# Altium project UZ_D_Inverter.PrjPCB (part 2 of 2)

## Sheet Halfbridges.SchDoc
size A4; Author: K.Patel / D. Hufnagel; CompanyName: Technische Hochschule Nürnberg Georg Simon Ohm; Organization: UltraZohm; Address1: Kesslerplatz 12; Address2: 90489 Nürnberg; Address3: GERMANY; SheetNumber: 5; SheetTotal: 9; Website: www.ultrazohm.com
Used 3 times, as channels Halfbridge1, Halfbridge2, Halfbridge3. Parts and nets are listed once, with the designators drawn on the sheet.
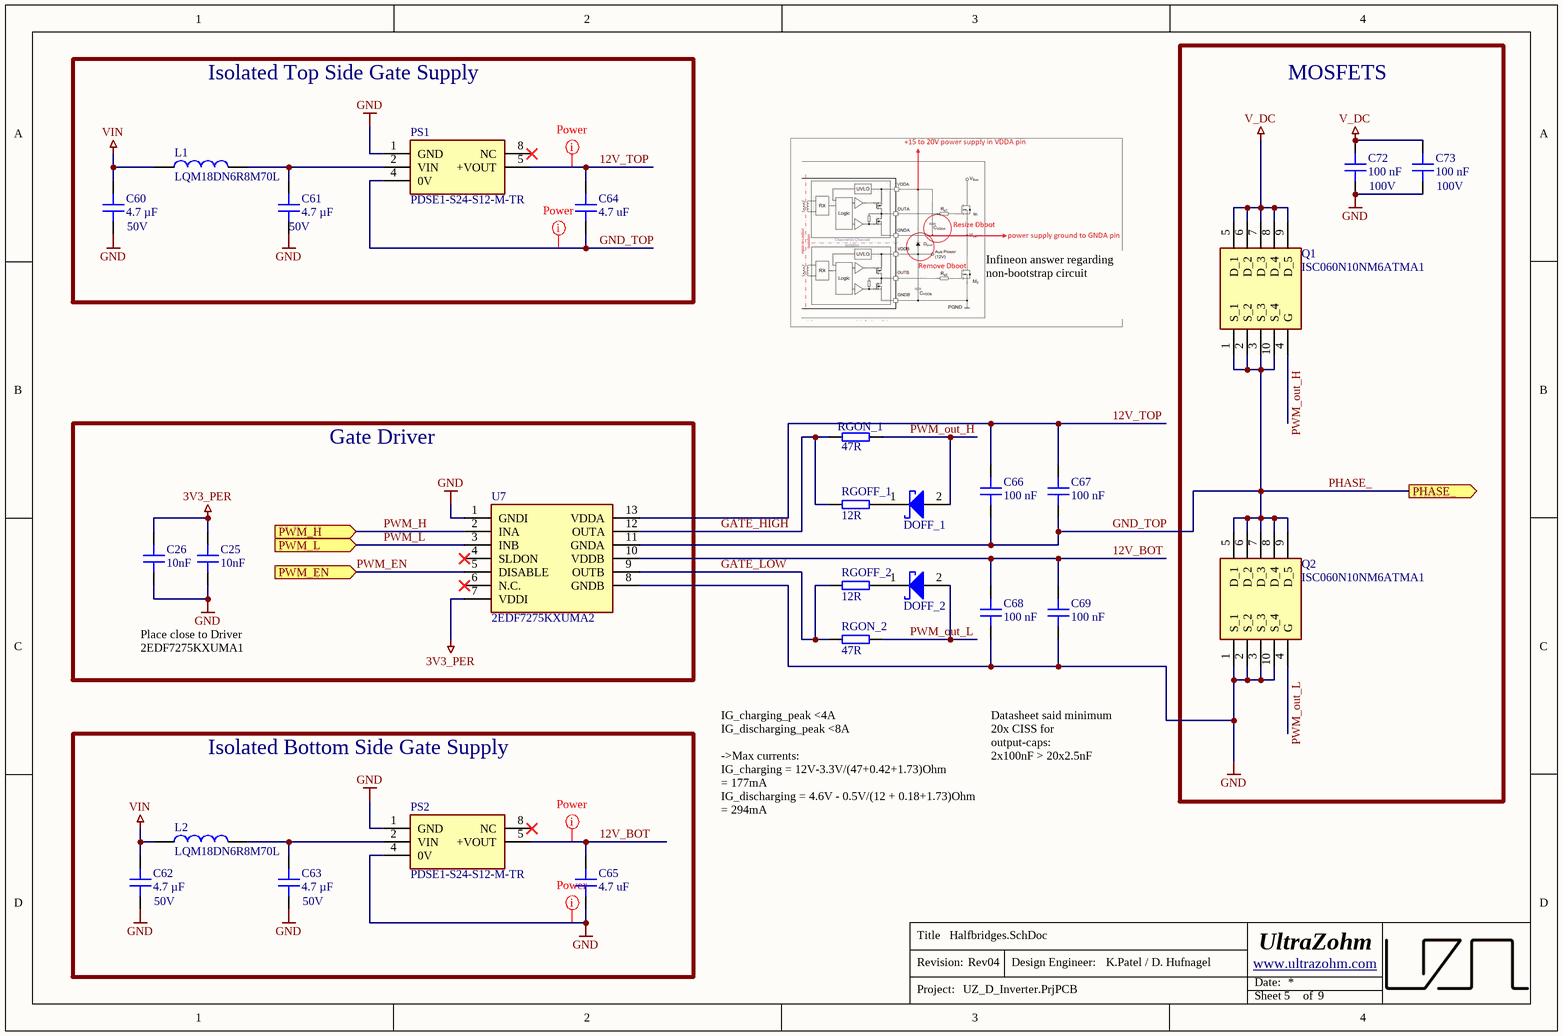
[diagram p4: Halfbridges.SchDoc]

### Parts
C25  10nF  [C_0603]
C26  10nF  [C_0603]
C60  4.7 µF  [C_0805]
C61  4.7 µF  [C_0805]
C62  4.7 µF  [C_0805]
C63  4.7 µF  [C_0805]
C64  4.7 uF  [C_0603]
C65  4.7 uF  [C_0603]
C66  100 nF  [C_0603]
C67  100 nF  [C_0603]
C68  100 nF  [C_0603]
C69  100 nF  [C_0603]
C72  100 nF  [C_0603]
C73  100 nF  [C_0603]
DOFF_1  BAT165E6327  [SOD2513X110N]  (value not drawn)
DOFF_2  BAT165E6327  [SOD2513X110N]  (value not drawn)
L1  LQM18DN6R8M70L  [INDC1608X95N]
L2  LQM18DN6R8M70L  [INDC1608X95N]
PS1  PDSE1-S24-S12-M-TR  [PDSE1S24S12MTR]
PS2  PDSE1-S24-S12-M-TR  [PDSE1S24S12MTR]
Q1  ISC060N10NM6ATMA1  [ISC060N10NM6ATMA1]
Q2  ISC060N10NM6ATMA1  [ISC060N10NM6ATMA1]
RGOFF_1  12R  [RESC1609X55N]
RGOFF_2  12R  [RESC1609X55N]
RGON_1  47R  [RESC1609X55N]
RGON_2  47R  [RESC1609X55N]
U7  2EDF7275KXUMA2  [2EDF7275KXUMA1]

### Blocks framed on the sheet
Isolated Top Side Gate Supply: C60 C61 C64 L1 PS1
MOSFETS: C72 C73 Q1 Q2
Gate Driver: C25 C26 U7
Isolated Bottom Side Gate Supply: C62 C63 C65 L2 PS2

### Ports
PHASE_ (out), PWM_EN (in), PWM_H (in), PWM_L (in)

### Nets
3V3_PER: C25.2 C26.2 U7.7(VDDI)
GND: C25.1 C26.1 C60.2 C61.2 C62.2 C63.2 C65.1 C68.1 C69.1 C72.1 C73.1 PS1.1(GND) PS2.1(GND) PS2.4(0V) Q2.1(S_1) Q2.2(S_2) Q2.3(S_3) Q2.10(S_4) U7.1(GNDI) U7.8(GNDB)
V_DC: C72.2 C73.2 Q1.5(D_1) Q1.6(D_2) Q1.7(D_3) Q1.8(D_4) Q1.9(D_5)
VIN: C60.1 C62.1 L1.1 L2.1
12V_BOT: C65.2 C68.2 C69.2 PS2.5(+VOUT) U7.10(VDDB)
12V_TOP: C64.2 C66.2 C67.2 PS1.5(+VOUT) U7.13(VDDA)
GATE_HIGH: RGOFF_1.1 RGON_1.1 U7.12(OUTA)
GATE_LOW: RGOFF_2.1 RGON_2.1 U7.9(OUTB)
GND_TOP: C64.1 C66.1 C67.1 PS1.4(0V) Q1.1(S_1) Q1.2(S_2) Q1.3(S_3) Q1.10(S_4) Q2.5(D_1) Q2.6(D_2) Q2.7(D_3) Q2.8(D_4) Q2.9(D_5) U7.11(GNDA) ; port PHASE_  [also labelled PHASE_]
PWM_EN: U7.5(DISABLE) ; port PWM_EN
PWM_H: U7.2(INA) ; port PWM_H
PWM_L: U7.3(INB) ; port PWM_L
PWM_out_H: DOFF_1.2(A) Q1.4(G) RGON_1.2
PWM_out_L: DOFF_2.2(A) Q2.4(G) RGON_2.2
NetC61_1: C61.1 L1.2 PS1.2(VIN)
NetC63_1: C63.1 L2.2 PS2.2(VIN)
NetDOFF_1_1: DOFF_1.1(K) RGOFF_1.2
NetDOFF_2_1: DOFF_2.1(K) RGOFF_2.2

Not connected (* = marked no-connect by the designer): PS1 8(NC)*; PS2 8(NC)*; U7 4(SLDON)* 6(N.C.)*

### Channels
Halfbridge1: designators end in A; ports PHASE_=GND_TOP PWM_EN=PWM_EN PWM_H=PWM_H PWM_L=PWM_L
Halfbridge2: designators end in B; ports PHASE_=GND_TOP PWM_EN=PWM_EN PWM_H=PWM_H PWM_L=PWM_L
Halfbridge3: designators end in C; ports PHASE_=GND_TOP PWM_EN=PWM_EN PWM_H=PWM_H PWM_L=PWM_L

### Layout directives
net class Power: 12V_BOT_Halfbridge1, 12V_TOP_Halfbridge1, GND, GND_TOP

### Notes on the sheet
- (near C60) 50V
- (near C61) 50V
- (near C72) 100V
- (near C73) 100V
- Infineon answer regarding non-bootstrap circuit
- Place close to Driver
  2EDF7275KXUMA1
- Datasheet said minimum 20x CISS for output-caps:
  2x100nF > 20x2.5nF
- IG_charging_peak <4A
  IG_discharging_peak <8A
  ->Max currents:
  IG_charging = 12V-3.3V/(47+0.42+1.73)Ohm
  = 177mA
  IG_discharging = 4.6V - 0.5V/(12 + 0.18+1.73)Ohm = 294mA
- (near C62) 50V
- (near C63) 50V
- Title
- Revision:
- Design Engineer:
- Date:
- Project:
- Sheet
- of

### Library data of the parts
C25 C26 = CT41G-0603-2X1-50V-0.01μF-K(N): 50V 10nF 2X1 ±10%; Manufacturer: TORCH; Voltage Rating: 50 VDC; Created from: KIlhan; Manufacturer Part Number: CT41G-0603-2X1-50V-0.01μF-K(N); PartID: 130; Created On: 05.07.2023 18:57:50; ComponentLink1Description: Datasheet; ComponentLink1URL: https://datasheet.lcsc.com/lcsc/1809291621_TORCH-CT41G-0603-2X1-50V-0-01-F-K-N_C136131.pdf; Component Type: Capacitor 0603; Device Package: 0603; Last Updated: 05.07.2023 18:57:50; Mounting Type: SMD; Operating Temperature: -55 - 125°C; Supplier 1: LCSC; Supplier Part Number 1: C136131; Type: Capacitor; Tolerance: 10 %; Value: 10nF; Live Cycle Status: 1; Stock number: not stored; LCSC Part Number: C136131
C60-C63 = C2012X7R1H475K125AC: Capacitor 0805, 50 VDC, 4.7 µF, X7R; Manufacturer: TDK; Tolerance: 10 %; Voltage Rating: 50 VDC; Created from: MGremer; Manufacturer Part Number: C2012X7R1H475K125AC; PartID: 15; Created On: 20.12.2020 13:54:13; ComponentLink1Description: Datasheet; ComponentLink1URL: https://product.tdk.com/info/en/catalog/datasheets/mlcc_commercial_general_en.pdf; Component Type: Capacitor 0805; Device Package: 0805; Last Updated: 21.02.2024 14:33:48; Mounting Type: SMD; Operating Temperature: -55 - 125°C; Series: C; Supplier 1: Mouser; Supplier Part Number 1: 810-C2012X7R475K125C; Type: Capacitor; Value: 4.7 µF; Live Cycle Status: 1; Stock number: Labor SMD Container; Supplier 2: LCSC; Supplier Part Number 2: C437557; LCSC Part Number: C437557
C64 C65 = C1608JB1V475M080AC: Multilayer Ceramic Capacitors MLCC - SMD/SMT RECOMMENDED ALT 810-C1608X5R1V475K; Manufacturer: TDK; Tolerance: 20 %; Voltage Rating: 35 VDC; Created from: KPatel; Manufacturer Part Number: C1608JB1V475M080AC; PartID: 159; Created On: 12/20/2020 1:54:13 PM; ComponentLink1Description: Datasheet; ComponentLink1URL: https://product.tdk.com/system/files/dam/doc/product/capacitor/ceramic/mlcc/catalog/mlcc_commercial_general_en.pdf; Component Type: Capacitor 0603; Device Package: 0603; Last Updated: 12/14/2022 12:14:21 PM; Mounting Type: SMD; Operating Temperature: -55 to 125°C; Series: X7R; Supplier 1: LCSC; Supplier Part Number 1: C3858973; Type: Capacitor; Value: 4.7 uF; Live Cycle Status: 1; LCSC Part Number: C3858973; Stock number: not stored
C66-C69 C72 C73 = C1608X7S2A104KT000N: 100V 100nF X7S ±10% 0603 Multilayer Ceramic Capacitors MLCC - SMD/SMT ROHS; Manufacturer: TDK; Voltage Rating: 100 VDC; Created from: AGeiger; Manufacturer Part Number: C1608X7S2A104KT000N; PartID: 148; Created On: 20.12.2020 13:54:13; ComponentLink1Description: Datasheet; ComponentLink1URL: https://datasheet.lcsc.com/lcsc/2304140030_TDK-C1608X7S2A104KT000N_C343025.pdf; Component Type: Capacitor 0603; Device Package: 0603; Last Updated: 14.12.2022 12:14:21; Mounting Type: SMD; Operating Temperature: -55 to 125°C; Series: X7R; Supplier 1: LCSC; Supplier Part Number 1: C343025; Type: Capacitor; Tolerance: 10 %; Value: 100 nF; Live Cycle Status: 1; Stock number: not stored; LCSC Part Number: C343025
DOFF_1 DOFF_2 = BAT165E6327: Schottky Diode, 40 V, 750mA; Manufacturer: Infineon Technologies; Forward Current: 0.75 A; Forward Voltage: 40V; Reverse Current: 50uA; Value: 40V; Created from: Kpatel; Manufacturer Part Number: BAT165E6327; PartID: 19; Created On: 6/11/2024 12:14:10 PM; ComponentLink1Description: Datasheet; ComponentLink1URL: https://www.mouser.de/datasheet/2/196/bat165series-12207.pdf; Component Type: Schottky Diode; Device Package: SOD-323-2; Last Updated: 7/30/2024 11:32:39 AM; Mounting Type: SMD; Operating Temperature: -65 - 150 °C; Series: BAT165; Supplier 1: Mouser; Supplier Part Number 1: 726-BAT165E6327; Supplier 2: JLC; Supplier Part Number 2: C533629; Type: Schottky Diode; Live Cycle Status: 1; Stock number: not stored
L1 L2 = LQM18DN6R8M70L: 6.8µH, 120mA, 0603, 740mOhm, 20%; Manufacturer: Murata; MF: EPCOS / TDK; Value: 6.8uH; DCR: 320m; Rated Current: 0.85 A; Type: fixed inductor; Created from: DHufnagel; MPN: B82464G4154M; Supplier 1: Mouser; Supplier Part Number 1: 81-LQM18DN6R8M70L; Manufacturer Part Number: LQM18DN6R8M70L; PartID: 10; Created On: 19.07.2022 15:47:17; ComponentLink1Description: Datasheet; ComponentLink1URL: https://www.mouser.de/datasheet/2/281/1/JELF243B_0086-2298241.pdf; Component Type: SMD fixed inductor; Device Package: SMD; Last Updated: 15.06.2023 16:03:16; Mounting Type: SMD; Operating Temperature: -40 - 125°C; Series: LQM18DN_70; Supplier 2: Digi-Key; Supplier Part Number 2: 490-LQM18DN6R8M70LCT-ND; DC current: 120mA; Live Cycle Status: 1; Stock number: not stored; LCSC Part Number: C1881372
PS1 PS2 = PDSE1-S24-S12-M-TR: Isolated, 21.6 -26.4Vin, 12V out, 1W, 84mA out; Manufacturer: CUI Inc.; Created from: DHufnagel; Manufacturer Part Number: PDSE1-S24-S12-M-TR; PartID: 21; Created On: 19.07.2022 14:22:00; ComponentLink1Description: Datasheet; ComponentLink1URL: https://www.mouser.de/datasheet/2/670/pdse1_m-1596038.pdf; Component Type: Isolated DC-DC Converter; Device Package: SMT-5; Last Updated: 05.07.2023 17:07:31; Mounting Type: SMT; Operating Temperature: -40 - 105°C; Series: PDSE1-M; Supplier 1: Mouser; Supplier Part Number 1: 490-PDSE1-S24-S12MTR; Supplier 2: Digi-Key; Supplier Part Number 2: 102-PDSE1-S24-S12-M-TRCT-ND; Type: isolated DC-DC Converter; Value: 1 W; Live Cycle Status: 1; Stock number: not stored; LCSC Part Number: C6730719
Q1 Q2 = ISC060N10NM6ATMA1: Power MOSFET, n-Channel, 97A, 100V; Manufacturer: Infineon Technologies; Value: 100V, 97A; Created from: DHufnagel; Manufacturer Part Number: ISC060N10NM6ATMA1; PartID: 3; Created On: 28.06.2022 07:55:49; ComponentLink1Description: Datasheet; ComponentLink1URL: https://www.mouser.de/datasheet/2/196/Infineon_ISC060N10NM6_DataSheet_v02_00_EN-2942434.pdf; Component Type: Power MOSFET; Device Package: PG-TDSON-8 FL; Last Updated: 21.02.2024 15:31:45; Mounting Type: SMD; Operating Temperature: -55 - 175°C; Series: ISC060N10; Supplier 1: Mouser; Supplier Part Number 1: 726-ISC060N10NM6ATMA; Supplier 2: RS-online; Supplier Part Number 2: 235-4869; Type: Power MOSFET; Live Cycle Status: 1; Stock number: not stored; Supplier 3: LCSC; Supplier Part Number 3: C3288847; LCSC Part Number: C3288847
RGOFF_1 RGOFF_2 = RT0603WRC0712RL: SMD resistor E24 series; Manufacturer: YAGEO; Tolerance: 0.05%; Created from: K.Patel; Manufacturer Part Number: RT0603WRC0712RL; PartID: 349; Created On: 8/14/2024 5:03:13 PM; ComponentLink1Description: Datasheet; ComponentLink1URL: https://wmsc.lcsc.com/wmsc/upload/file/pdf/v2/lcsc/2403111543_YAGEO-RT0603WRC0712RL_C1720876.pdf; Component Type: SMD resistor; Device Package: 0603; Last Updated: 8/14/2024 5:03:13 PM; Mounting Type: SMD; Supplier 1: Mouser; Supplier Part Number 1: C1720876; Supplier 2: LCSC; Supplier Part Number 2: C1720876; Type: Resistor; Value: 12R; Live Cycle Status: 1; LCSC Part Number: C1720876
RGON_1 RGON_2 = RT0603WRC0747RL: SMD resistor E24 series; Manufacturer: YAGEO; Tolerance: 0.05%; Created from: K.Patel; Manufacturer Part Number: RT0603WRC0747RL; PartID: 350; Created On: 8/14/2024 5:03:13 PM; ComponentLink1Description: Datasheet; ComponentLink1URL: https://wmsc.lcsc.com/wmsc/upload/file/pdf/v2/lcsc/2403111541_YAGEO-RT0603WRC0747RL_C1718809.pdf; Component Type: SMD resistor; Device Package: 0603; Last Updated: 8/14/2024 5:03:13 PM; Mounting Type: SMD; Supplier 1: Mouser; Supplier Part Number 1: C1718809; Supplier 2: LCSC; Supplier Part Number 2: C1718809; Type: Resistor; Value: 47R; Live Cycle Status: 1; LCSC Part Number: C1718809
U7 = 2EDF7275KXUMA2: Gate Driver  8A, 1.5 kV, daul channel isolated gate driver; Manufacturer: Infineon Technologies; Created from: AGeiger; Manufacturer Part Number: 2EDF7275KXUMA2; PartID: 7; Created On: 21.02.2024 16:40:21; ComponentLink1Description: Datasheet; ComponentLink1URL: https://datasheet.lcsc.com/lcsc/2202151130_Infineon-Technologies-2EDF7275KXUMA2_C2975252.pdf; Component Type: Gate Driver; Device Package: PG-TFLGA-13-1; Last Updated: 21.02.2024 16:40:21; Mounting Type: SMD; Operating Temperature: -40 - 125°C; Supplier 1: LCSC; Supplier Part Number 1: C2975252; Type: Gate Driver; Live Cycle Status: 1; Stock number: not stored; LCSC Part Number: C2975252

## Sheet DC-link.SchDoc
size A4; Author: K.Patel / D. Hufnagel; CompanyName: Technische Hochschule Nürnberg Georg Simon Ohm; Organization: UltraZohm; Address1: Kesslerplatz 12; Address2: 90489 Nürnberg; Address3: GERMANY; SheetNumber: 6; SheetTotal: 9; Website: www.ultrazohm.com
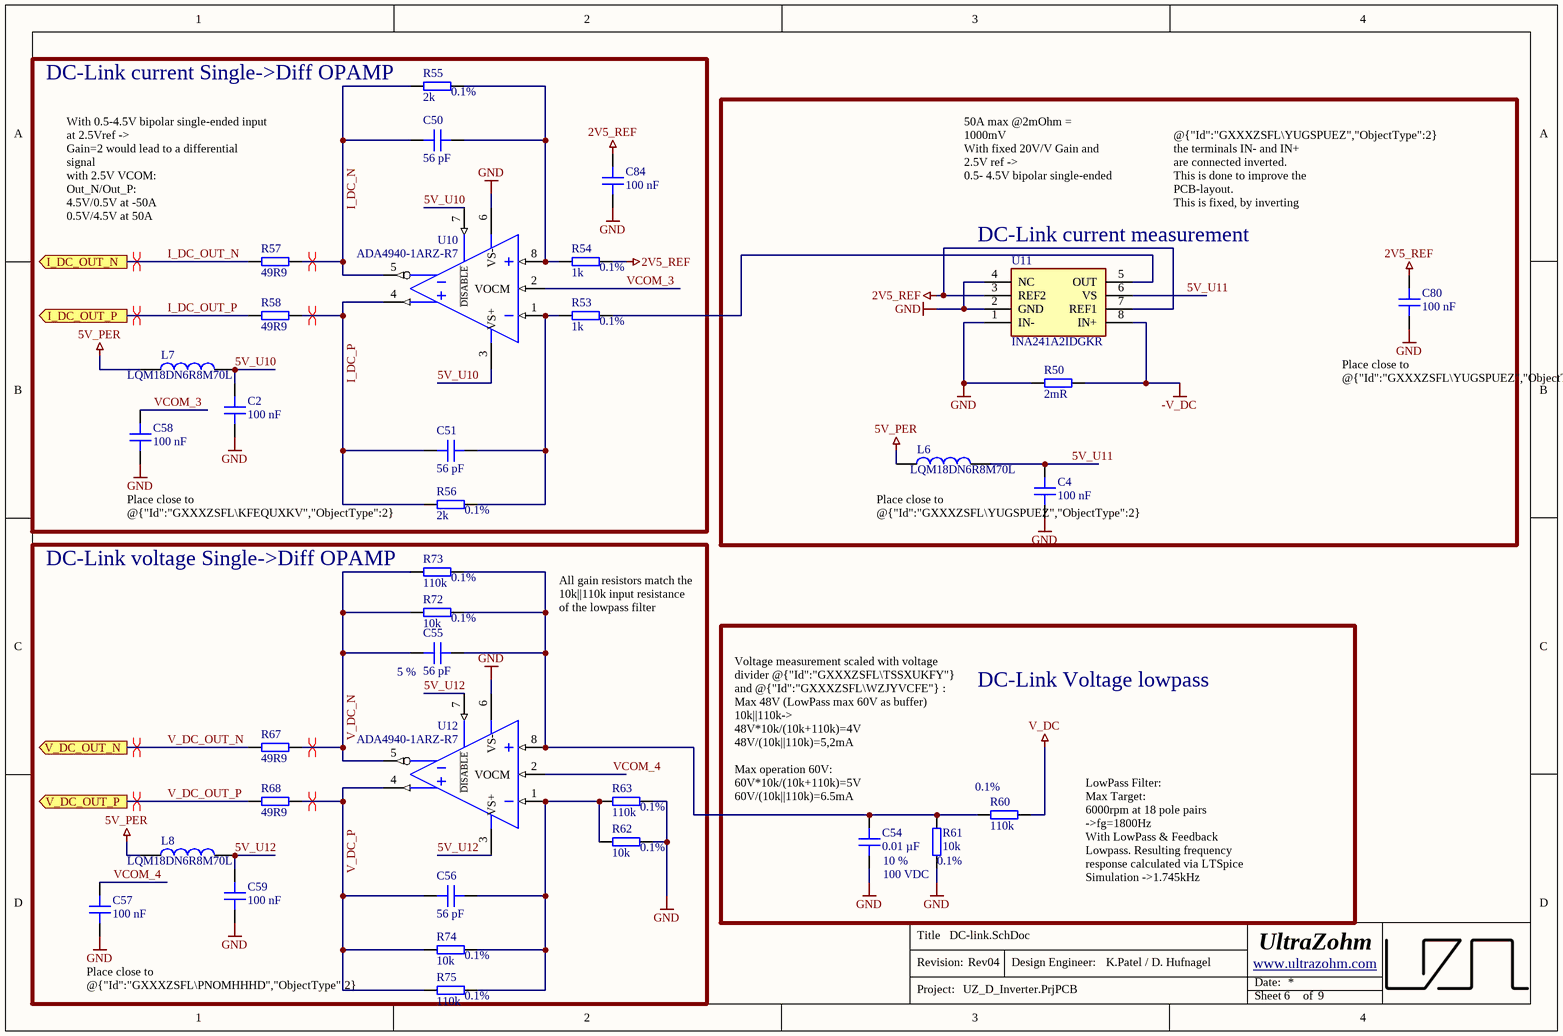
[diagram p5: DC-link.SchDoc]

### Parts
C2  100 nF  [C_0603]
C4  100 nF  [C_0603]
C50  56 pF  [C_0603]
C51  56 pF  [C_0603]
C54  0.01 µF  Tolerance: 10 %  Voltage Rating: 100 VDC  [C_0805]
C55  56 pF  Tolerance: 5 %  [C_0603]
C56  56 pF  [C_0603]
C57  100 nF  [C_0603]
C58  100 nF  [C_0603]
C59  100 nF  [C_0603]
C80  100 nF  [C_0603]
C84  100 nF  [C_0603]
L6  LQM18DN6R8M70L  [INDC1608X95N]
L7  LQM18DN6R8M70L  [INDC1608X95N]
L8  LQM18DN6R8M70L  [INDC1608X95N]
R50  2mR  [3921]
R53  1k  Tolerance: 0.1%  [RES 0603_1608]
R54  1k  Tolerance: 0.1%  [RES 0603_1608]
R55  2k  Tolerance: 0.1%  [RES 0603_1608]
R56  2k  Tolerance: 0.1%  [RES 0603_1608]
R57  49R9  [RES 0603_1608]
R58  49R9  [RES 0603_1608]
R60  110k  Tolerance: 0.1%  [RES 0603_1608]
R61  10k  [RES 0603_1608]
R62  10k  Tolerance: 0.1%  [RES 0603_1608]
R63  110k  Tolerance: 0.1%  [RES 0603_1608]
R67  49R9  [RES 0603_1608]
R68  49R9  [RES 0603_1608]
R72  10k  Tolerance: 0.1%  [RES 0603_1608]
R73  110k  Tolerance: 0.1%  [RES 0603_1608]
R74  10k  Tolerance: 0.1%  [RES 0603_1608]
R75  110k  Tolerance: 0.1%  [RES 0603_1608]
U10  ADA4940-1ARZ-R7  [SOT127P600X175-8N]
U11  INA241A2IDGKR  [SOP65P490X110-8N]
U12  ADA4940-1ARZ-R7  [SOT127P600X175-8N]

### Blocks framed on the sheet
DC-Link current Single->Diff OPAMP: C2 C50 C51 C58 C84 L7 R53-R58 U10
DC-Link current measurement: C4 C80 L6 R50 U11
DC-Link voltage Single->Diff OPAMP: C55-C57 C59 L8 R62 R63 R67 R68 R72-R75 U12
DC-Link Voltage lowpass: C54 R60 R61

### Ports
I_DC_OUT_N (out), I_DC_OUT_P (out), V_DC_OUT_N (out), V_DC_OUT_P (out)

### Nets
2V5_REF: C80.2 C84.2 R54.2 U11.3(REF2) U11.7(REF1)
5V_PER: L6.1 L7.1 L8.1
-V_DC: R50.2 U11.8(IN+)
GND: C2.1 C4.1 C54.1 C57.1 C58.1 C59.1 C80.1 C84.1 R50.1 R61.1 R62.1 R63.2 U10.6(VS-) U11.1(IN-) U11.2(GND) U11.4(NC) U12.6(VS-)
V_DC: R60.2
5V_U10: C2.2 L7.2 U10.3(VS+) U10.7(~{DISABLE})
5V_U11: C4.2 L6.2 U11.6(VS)
5V_U12: C59.2 L8.2 U12.3(VS+) U12.7(~{DISABLE})
I_DC_N: C50.1 R55.1 R57.2 U10.5(VOUT-)
I_DC_OUT_N: R57.1 ; port I_DC_OUT_N
I_DC_OUT_P: R58.1 ; port I_DC_OUT_P
I_DC_P: C51.2 R56.2 R58.2 U10.4(VOUT+)
V_DC_N: C55.1 R67.2 R72.2 R73.1 U12.5(VOUT-)
V_DC_OUT_N: R67.1 ; port V_DC_OUT_N
V_DC_OUT_P: R68.1 ; port V_DC_OUT_P
V_DC_P: C56.2 R68.2 R74.2 R75.1 U12.4(VOUT+)
VCOM_3: C58.2 U10.2(VOCM)
VCOM_4: C57.2 U12.2(VOCM)
NetC50_2: C50.2 R54.1 R55.2 U10.8(VIN+)
NetC51_1: C51.1 R53.1 R56.1 U10.1(VIN-)
NetC54_2: C54.2 C55.2 R60.1 R61.2 R72.1 R73.2 U12.8(VIN+)
NetC56_1: C56.1 R62.2 R63.1 R74.1 R75.2 U12.1(VIN-)
NetR53_2: R53.2 U11.5(OUT)

### Layout directives
differential pair: I_DC_N, I_DC_OUT_N, I_DC_OUT_P, I_DC_P, V_DC_N, V_DC_OUT_N, V_DC_OUT_P, V_DC_P

### Notes on the sheet
- (near R57) With 0.5-4.5V bipolar single-ended input at 2.5Vref ->
  Gain=2 would lead to a differential signal
  with 2.5V VCOM:
  Out_N/Out_P:
  4.5V/0.5V at -50A
  0.5V/4.5V at 50A
- 50A max @2mOhm = 1000mV
  With fixed 20V/V Gain and 2.5V ref ->
  0.5- 4.5V bipolar single-ended
- @{"Id":"GXXXZSFL\YUGSPUEZ","ObjectType":2} the terminals IN- and IN+ are connected inverted. This is done to improve the PCB-layout.
  This is fixed, by inverting the inputs at @{"Id":"GXXXZSFL\KFEQUXKV","ObjectType":2} again.
- (near C80) Place close to @{"Id":"GXXXZSFL\YUGSPUEZ","ObjectType":2} REF inputs
- (near C58) Place close to @{"Id":"GXXXZSFL\KFEQUXKV","ObjectType":2} OPAMP
- Place close to @{"Id":"GXXXZSFL\YUGSPUEZ","ObjectType":2} OPAMP
- All gain resistors match the 10k||110k input resistance of the lowpass filter
- Voltage measurement scaled with voltage divider @{"Id":"GXXXZSFL\TSSXUKFY"} and @{"Id":"GXXXZSFL\WZJYVCFE"} :
  Max 48V (LowPass max 60V as buffer)
  10k||110k->
  48V*10k/(10k+110k)=4V
  48V/(10k||110k)=5,2mA
  Max operation 60V:
  60V*10k/(10k+110k)=5V
  60V/(10k||110k)=6.5mA
- (near R61) 0.1%
- LowPass Filter:
  Max Target:
  6000rpm at 18 pole pairs
  ->fg=1800Hz
  With LowPass & Feedback Lowpass. Resulting frequency response calculated via LTSpice Simulation ->1.745kHz
- Place close to @{"Id":"GXXXZSFL\PNOMHHHD","ObjectType":2} OPAMP
- Title
- Revision:
- Design Engineer:
- Date:
- Project:
- Sheet
- of

### Library data of the parts
C2 C4 C57-C59 C80 C84 = C1608X7S2A104KT000N: as C66 on sheet Halfbridges; Manufacturer Part Number: C1608X7S2A104KT000N; PartID: 148; Created On: 20.12.2020 13:54:13; ComponentLink1Description: Datasheet; ComponentLink1URL: https://datasheet.lcsc.com/lcsc/2304140030_TDK-C1608X7S2A104KT000N_C343025.pdf; Component Type: Capacitor 0603; Device Package: 0603; Last Updated: 14.12.2022 12:14:21; Mounting Type: SMD; Operating Temperature: -55 to 125°C; Series: X7R; Supplier 1: LCSC; Supplier Part Number 1: C343025; Type: Capacitor; Tolerance: 10 %; Value: 100 nF; Live Cycle Status: 1; Stock number: not stored; LCSC Part Number: C343025
C50 C51 C56 = CL10C560JB8NNNC: Capacitor 0603, 50 VDC, 56 pF, C0G; Manufacturer: Samsung Electro-Mechanics; Tolerance: 5 %; Voltage Rating: 50 VDC; Created from: DHufnagel; Manufacturer Part Number: CL10C560JB8NNNC; PartID: 92; Created On: 20.12.2020 13:54:13; ComponentLink1Description: Datasheet; ComponentLink1URL: https://www.mouser.de/datasheet/2/585/MLCC-1837944.pdf; Component Type: Capacitor 0603; Device Package: 0603; Last Updated: 20.12.2020 16:24:16; Mounting Type: SMD; Operating Temperature: -55 - 125°C; Series: CL; Supplier 1: Mouser; Supplier Part Number 1: 187-CL10C560JB8NNNC; Supplier 2: LCSC; Supplier Part Number 2: C39148; Type: Capacitor; Value: 56 pF; Live Cycle Status: 1; LCSC Part Number: C39148; Stock number: not stored
C54 = HV0805X7R103K101NT: 100V 10nF 0805 Multilayer Ceramic Capacitors MLCC - SMD/SMT ROHS; Manufacturer: AIDE; Created from: KIlhan; Manufacturer Part Number: HV0805X7R103K101NT; PartID: 128; Created On: 05.07.2023 15:42:28; ComponentLink1Description: Datasheet; ComponentLink1URL: https://datasheet.lcsc.com/lcsc/2103311437_AIDE-HV1210X7R332K202NT_C2691813.pdf; Component Type: Capacitor 0805; Device Package: 0805; Last Updated: 05.07.2023 15:42:28; Mounting Type: SMD; Operating Temperature: -55 - 125°C; Series: C; Supplier 1: JLCPCB; Supplier Part Number 1: HV0805X7R103K101NT; Type: Capacitor; Value: 0.01 µF; Live Cycle Status: 1; Stock number: not stored; LCSC Part Number: C2691724
C55 = CL10C560JB8NNNC: Capacitor 0603, 50 VDC, 56 pF, C0G; Manufacturer: Samsung Electro-Mechanics; Voltage Rating: 50 VDC; Created from: DHufnagel; Manufacturer Part Number: CL10C560JB8NNNC; PartID: 92; Created On: 20.12.2020 13:54:13; ComponentLink1Description: Datasheet; ComponentLink1URL: https://www.mouser.de/datasheet/2/585/MLCC-1837944.pdf; Component Type: Capacitor 0603; Device Package: 0603; Last Updated: 20.12.2020 16:24:16; Mounting Type: SMD; Operating Temperature: -55 - 125°C; Series: CL; Supplier 1: Mouser; Supplier Part Number 1: 187-CL10C560JB8NNNC; Type: Capacitor; Value: 56 pF; Live Cycle Status: 1; Stock number: not stored; Supplier 2: LCSC; Supplier Part Number 2: C39148; LCSC Part Number: C39148
L6-L8 = LQM18DN6R8M70L: as L1 on sheet Halfbridges; MPN: B82464G4154M; Supplier 1: Mouser; Supplier Part Number 1: 81-LQM18DN6R8M70L; Manufacturer Part Number: LQM18DN6R8M70L; PartID: 10; Created On: 19.07.2022 15:47:17; ComponentLink1Description: Datasheet; ComponentLink1URL: https://www.mouser.de/datasheet/2/281/1/JELF243B_0086-2298241.pdf; Component Type: SMD fixed inductor; Device Package: SMD; Last Updated: 15.06.2023 16:03:16; Mounting Type: SMD; Operating Temperature: -40 - 125°C; Series: LQM18DN_70; Supplier 2: Digi-Key; Supplier Part Number 2: 490-LQM18DN6R8M70LCT-ND; DC current: 120mA; Live Cycle Status: 1; Stock number: not stored; LCSC Part Number: C1881372
R50 = PU3921FKMP50R002L: Shunt resistor 2mOhm, 5W, 1%; Manufacturer Part Number: WSL39212L000FEA; Manufacturer: Vishay; Created from: DHufnagel; PartID: 236; Created On: 12.07.2022 07:38:48; ComponentLink1Description: Datasheet; ComponentLink1URL: https://www.mouser.de/datasheet/2/447/PYu_PU_51_RoHS_L_8-3003083.pdf; Component Type: Shunt SMD resistor; Device Package: 3921; Last Updated: 16.06.2023 12:23:12; Mounting Type: SMD; Supplier 1: Mouser; Supplier Part Number 1: 71-WSL39212L000FEA; Type: Shunt; Tolerance: 1%; Value: 2mR; Live Cycle Status: 1; Stock number: not stored; LCSC Part Number: C844494
R53 R54 = PCF-W0603LF-03-1001-B-P-LT: SMD resistor 0.1%; Manufacturer: IRC / TT Electronics; Created from: MGremer; Manufacturer Part Number: PCF-W0603LF-03-1001-B-P-LT; PartID: 163; Created On: 14.12.2020 16:17:14; ComponentLink1Description: Datasheet; ComponentLink1URL: https://www.mouser.de/datasheet/2/414/PCF-1528243.pdf; Component Type: SMD resistor; Device Package: 0603; Last Updated: 21.02.2024 15:45:55; Mounting Type: SMD; Supplier 1: Mouser; Supplier Part Number 1: 66-PCFW0603LF031001B; Type: Resistor; Value: 1k; Live Cycle Status: 1; Stock number: not stored; LCSC Part Number: C110776
R55 R56 = ERJ-PB3B2001V: SMD resistor 0.1%; Manufacturer: Panasonic; Created from: DHufnagel; Manufacturer Part Number: ERJ-PB3B2001V; PartID: 215; Created On: 14.12.2020 16:17:14; ComponentLink1Description: Datasheet; ComponentLink1URL: https://www.mouser.de/datasheet/2/315/AOA0000C328-1530132.pdf; Component Type: SMD resistor; Device Package: 0603; Last Updated: 02.03.2021 14:07:32; Mounting Type: SMD; Supplier 1: Mouser; Supplier Part Number 1: 667-ERJ-PB3B2001V; Supplier 2: LCSC; Supplier Part Number 2: C189729; Type: Resistor; Value: 2k; Live Cycle Status: 1; Stock number: not stored; LCSC Part Number: C189729
R57 R58 R67 R68 = RK73H1JTTD49R9F: SMD resistor 1%; Manufacturer: KOA Speer; Created from: DHufnagel; Manufacturer Part Number: RK73H1JTTD49R9F; PartID: 214; Created On: 14.12.2020 16:17:14; ComponentLink1Description: Datasheet; ComponentLink1URL: https://www.mouser.de/datasheet/2/219/RK73H-1825326.pdf; Component Type: SMD resistor; Device Package: 0603; Last Updated: 27.05.2022 13:46:35; Mounting Type: SMD; Supplier 1: Mouser; Supplier Part Number 1: 660-RK73H1JTTD49R9F; Supplier 2: LCSC; Supplier Part Number 2: C160046; Type: Resistor; Tolerance: 1%; Value: 49R9; Live Cycle Status: 1; Stock number: not stored; LCSC Part Number: C160046
R60 R63 R73 R75 = RQ73C1J110KBTD: SMD resistor 0.1%, 10ppm; Manufacturer: TE Connectivity / Holsworthy; Created from: DHufnagel; Manufacturer Part Number: RQ73C1J110KBTD; PartID: 216; Created On: 14.12.2020 16:17:14; ComponentLink1Description: Datasheet; ComponentLink1URL: https://www.mouser.de/datasheet/2/418/5/ENG_DS_1773270_2_B-1533717.pdf; Component Type: SMD resistor; Device Package: 0603; Last Updated: 21.02.2024 16:00:52; Mounting Type: SMD; Supplier 1: Mouser; Supplier Part Number 1: 279-RQ73C1J110KBTD; Type: Resistor; Value: 110k; Live Cycle Status: 1; Stock number: not stored; Supplier 2: LCSC; Supplier Part Number 2: C326736; LCSC Part Number: C326736
R61 R62 R72 R74 = RQ73C1J10KBTD: SMD resistor 0.1%, 10ppm; Manufacturer: TE Connectivity; Created from: DHufnagel; Manufacturer Part Number: RQ73C1J10KBTD; PartID: 231; Created On: 14.12.2020 16:17:14; ComponentLink1Description: Datasheet; ComponentLink1URL: https://www.mouser.de/datasheet/2/418/5/ENG_DS_1773270_2_B-1533717.pdf; Component Type: SMD resistor; Device Package: 0603; Last Updated: 21.02.2024 15:51:17; Mounting Type: SMD; Supplier 1: Mouser; Supplier Part Number 1: 279-RQ73C1J10KBTD; Type: Resistor; Value: 10k; Live Cycle Status: 1; Stock number: not stored; Supplier 2: LCSC; Supplier Part Number 2: C95204; LCSC Part Number: C95204
  R61: Tolerance: 0.1%
U10 U12 = ADA4940-1ARZ-R7: Fully Differential Amplifier, Ultralow-Power,Low Distortion, 260-MHz; Manufacturer: Analog Devices; Channels: 1; GBP: 260 MHz; CMRR: 86 dB; Created from: DHufnagel; Manufacturer Part Number: ADA4940-1ARZ-R7; PartID: 14; Created On: 18.08.2022 12:53:27; ComponentLink1Description: Datasheet; ComponentLink1URL: https://www.mouser.de/datasheet/2/609/ada4940_1_4940_2-2955874.pdf; Component Type: Differential Amplifier; Device Package: SOIC-8; Last Updated: 18.08.2022 13:04:18; Mounting Type: SMD; Operating Temperature: -40 - 105°C; Series: ADA4940-1; Supplier 1: Mouser; Supplier Part Number 1: 584-ADA4940-1ARZ; Supplier 2: Digi-Key; Supplier Part Number 2: 505-ADA4940-1ARZ-ND; Supplier 3: LCSC; Supplier Part Number 3: C730049; Type: Differential Amplifiers; Live Cycle Status: 1; LCSC Part Number: C730049; Stock number: not stored
U11 = INA241A2IDGKR: Current Sense Amplifier, 5-100 V  CMV, 20 V/V, bidirectional; Manufacturer: Texas Instruments; Channels: 1; GBP: 100MHz; CMRR: 89dB; Value: Rail-to-Rail; Created from: KPatel; Manufacturer Part Number: INA241A2IDGKR; PartID: 30; Created On: 6/28/2024 9:00:46 AM; ComponentLink1Description: Datasheet; ComponentLink1URL: https://www.ti.com/lit/ds/symlink/ina241b.pdf?ts=1718088817119&ref_url=https%253A%252F%252Fwww.mouser.de%252F; Component Type: Current Sense Amplifier; Device Package: VSSOP-8; Last Updated: 6/28/2024 9:00:46 AM; Mounting Type: SMD; Operating Temperature: -40 - 125°C; Series: INA241A; Supplier 1: Mouser; Supplier Part Number 1: 595-INA241A2IDGKR; Type: Current Sense Amplifier; Live Cycle Status: 1; Stock number: not stored

## Sheet Temp_Measurements.SchDoc
size A4; Author: K.Patel / D. Hufnagel; CompanyName: Technische Hochschule Nürnberg Georg Simon Ohm; Organization: UltraZohm; Address1: Kesslerplatz 12; Address2: 90489 Nürnberg; Address3: GERMANY; SheetNumber: 8; SheetTotal: 9; Website: www.ultrazohm.com
Used 3 times, as channels TempMeasurements1, TempMeasurements2, TempMeasurements3. Parts and nets are listed once, with the designators drawn on the sheet.
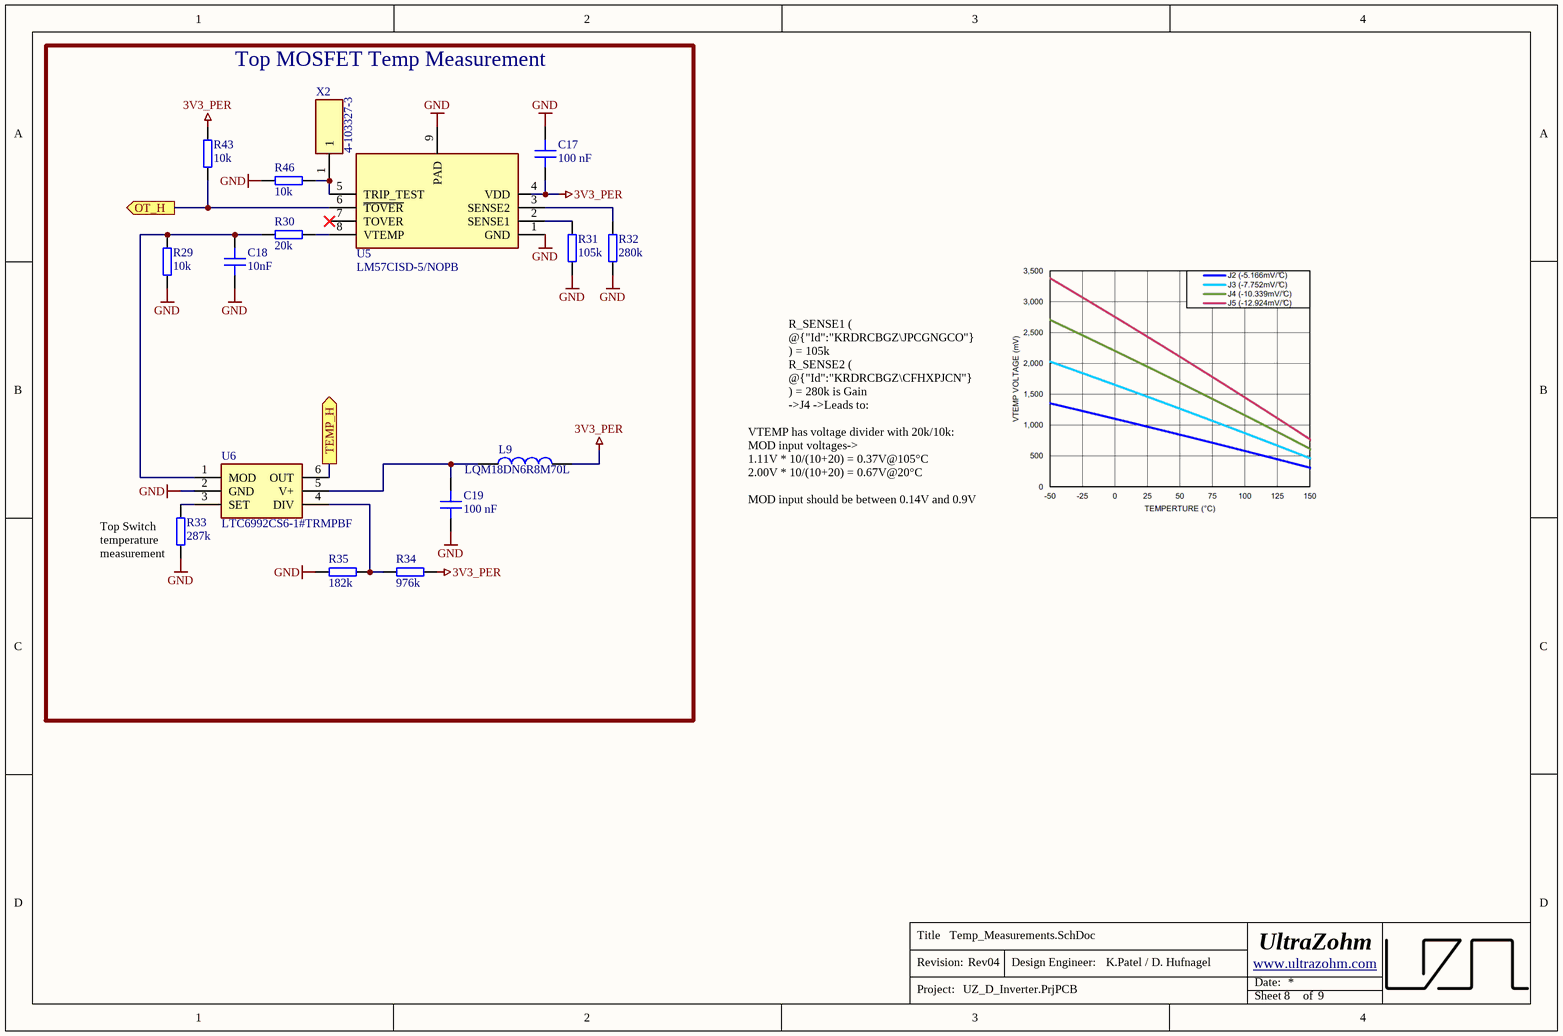
[diagram p6: Temp_Measurements.SchDoc]

### Parts
C17  100 nF  [C_0603]
C18  10nF  [C_0603]
C19  100 nF  [C_0603]
L9  LQM18DN6R8M70L  [INDC1608X95N]
R29  10k  [RES 0603_1608]
R30  20k  [RES 0603_1608]
R31  105k  [RES 0603_1608]
R32  280k  [RES 0603_1608]
R33  287k  [RES 0805_2012]
R34  976k  [RES 0603_1608]
R35  182k  [RES 0603_1608]
R43  10k  [RES 0603_1608]
R46  10k  [RES 0603_1608]
U5  LM57CISD-5/NOPB  [SON50P250X250X80-9N]
U6  LTC6992CS6-1#TRMPBF  [SOT95P280X100-6N]
X2  4-103327-3  [1_Pin_Header]

### Blocks framed on the sheet
Top MOSFET Temp Measurement: C17-C19 L9 R29-R35 R43 R46 U5 U6 X2

### Ports
OT_H (out), TEMP_H (out)

### Nets
3V3_PER: C17.1 L9.2 R34.2 R43.1 U5.4(VDD)
GND: C17.2 C18.1 C19.1 R29.2 R31.1 R32.1 R33.1 R35.1 R46.2 U5.1(GND) U5.9(PAD) U6.2(GND)
OT_H: R43.2 U5.6(~{TOVER}) ; port OT_H
TEMP_H: U6.6(OUT) ; port TEMP_H
NetC18_2: C18.2 R29.1 R30.1 U6.1(MOD)
NetC19_2: C19.2 L9.1 U6.5(V+)
NetR30_2: R30.2 U5.8(VTEMP)
NetR31_2: R31.2 U5.2(SENSE1)
NetR32_2: R32.2 U5.3(SENSE2)
NetR33_2: R33.2 U6.3(SET)
NetR34_1: R34.1 R35.2 U6.4(DIV)
NetR46_1: R46.1 U5.5(TRIP_TEST) X2.1

Not connected (* = marked no-connect by the designer): U5 7(TOVER)*

### Channels
TempMeasurements1: designators end in A; ports OT_H=OT_H1 TEMP_H=TEMP_H1
TempMeasurements2: designators end in B; ports OT_H=OT_H2 TEMP_H=TEMP_H2
TempMeasurements3: designators end in C; ports OT_H=OT_H3 TEMP_H=TEMP_H3

### Notes on the sheet
- R_SENSE1 ( @{"Id":"KRDRCBGZ\JPCGNGCO"} ) = 105k
  R_SENSE2 ( @{"Id":"KRDRCBGZ\CFHXPJCN"} ) = 280k is Gain
  ->J4 ->Leads to:
  1.11V@105°C
  2.00V@20°C
  /TOVER trips at 105°C
- VTEMP has voltage divider with 20k/10k:
  MOD input voltages->
  1.11V * 10/(10+20) = 0.37V@105°C
  2.00V * 10/(10+20) = 0.67V@20°C
  MOD input should be between 0.14V and 0.9V
- (near R33) Top Switch temperature measurement
- Title
- Revision:
- Design Engineer:
- Date:
- Project:
- Sheet
- of

### Library data of the parts
C17 C19 = C1608X7S2A104KT000N: as C66 on sheet Halfbridges; Manufacturer Part Number: C1608X7S2A104KT000N; PartID: 148; Created On: 20.12.2020 13:54:13; ComponentLink1Description: Datasheet; ComponentLink1URL: https://datasheet.lcsc.com/lcsc/2304140030_TDK-C1608X7S2A104KT000N_C343025.pdf; Component Type: Capacitor 0603; Device Package: 0603; Last Updated: 14.12.2022 12:14:21; Mounting Type: SMD; Operating Temperature: -55 to 125°C; Series: X7R; Supplier 1: LCSC; Supplier Part Number 1: C343025; Type: Capacitor; Tolerance: 10 %; Value: 100 nF; Live Cycle Status: 1; Stock number: not stored; LCSC Part Number: C343025
C18 = CT41G-0603-2X1-50V-0.01μF-K(N): as C25 on sheet Halfbridges; Manufacturer Part Number: CT41G-0603-2X1-50V-0.01μF-K(N); PartID: 130; Created On: 05.07.2023 18:57:50; ComponentLink1Description: Datasheet; ComponentLink1URL: https://datasheet.lcsc.com/lcsc/1809291621_TORCH-CT41G-0603-2X1-50V-0-01-F-K-N_C136131.pdf; Component Type: Capacitor 0603; Device Package: 0603; Last Updated: 05.07.2023 18:57:50; Mounting Type: SMD; Operating Temperature: -55 - 125°C; Supplier 1: LCSC; Supplier Part Number 1: C136131; Type: Capacitor; Tolerance: 10 %; Value: 10nF; Live Cycle Status: 1; Stock number: not stored; LCSC Part Number: C136131
L9 = LQM18DN6R8M70L: as L1 on sheet Halfbridges; MPN: B82464G4154M; Supplier 1: Mouser; Supplier Part Number 1: 81-LQM18DN6R8M70L; Manufacturer Part Number: LQM18DN6R8M70L; PartID: 10; Created On: 19.07.2022 15:47:17; ComponentLink1Description: Datasheet; ComponentLink1URL: https://www.mouser.de/datasheet/2/281/1/JELF243B_0086-2298241.pdf; Component Type: SMD fixed inductor; Device Package: SMD; Last Updated: 15.06.2023 16:03:16; Mounting Type: SMD; Operating Temperature: -40 - 125°C; Series: LQM18DN_70; Supplier 2: Digi-Key; Supplier Part Number 2: 490-LQM18DN6R8M70LCT-ND; DC current: 120mA; Live Cycle Status: 1; Stock number: not stored; LCSC Part Number: C1881372
R29 R43 R46 = RK73B1JTTD103J: SMD resistor E24 series; Manufacturer: KOA Speer; Tolerance: 5%; Created from: MGremer; Manufacturer Part Number: RK73B1JTTD103J; PartID: 98; Created On: 14.12.2020 16:17:14; ComponentLink1Description: Datasheet; ComponentLink1URL: https://www.mouser.de/datasheet/2/219/RK73B-1825463.pdf; Component Type: SMD resistor; Device Package: 0603; Last Updated: 27.05.2022 14:04:22; Mounting Type: SMD; Supplier 1: Mouser; Supplier Part Number 1: 660-RK73B1JTTD103J; Type: Resistor; Value: 10k; Live Cycle Status: 1; Stock number: Labor SMD Container; LCSC Part Number: C25804
R30 = RK73B1JTTD203J: SMD resistor E24 series; Manufacturer: KOA Speer; Tolerance: 5%; Created from: MGremer; Manufacturer Part Number: RK73B1JTTD203J; PartID: 105; Created On: 14.12.2020 16:17:14; ComponentLink1Description: Datasheet; ComponentLink1URL: https://www.mouser.de/datasheet/2/219/RK73B-1825463.pdf; Component Type: SMD resistor; Device Package: 0603; Last Updated: 27.05.2022 13:42:48; Mounting Type: SMD; Supplier 1: Mouser; Supplier Part Number 1: 660-RK73B1JTTD203J; Type: Resistor; Value: 20k; Live Cycle Status: 1; Stock number: Labor SMD Container; LCSC Part Number: C4184
R31 = CR0603-FX-1053ELF: SMD resistor 1%, 50V, 100ppm; Manufacturer: Bourns; Created from: DHufnagel; Manufacturer Part Number: CR0603-FX-1053ELF; PartID: 232; Created On: 25.07.2022 08:26:35; ComponentLink1Description: Datasheet; ComponentLink1URL: https://www.mouser.de/datasheet/2/54/cr-1858361.pdf; Component Type: SMD resistor; Device Package: 0603; Last Updated: 21.02.2024 16:03:36; Mounting Type: SMD; Supplier 1: Mouser; Supplier Part Number 1: 652-CR0603-FX1053ELF; Type: Resistor; Tolerance: 1%; Value: 105k; Live Cycle Status: 1; Stock number: not stored; Supplier 2: LCSC; Supplier Part Number 2: C141685; LCSC Part Number: C141685
R32 = CR0603-FX-2803ELF: SMD resistor 1%, 50V, 100ppm; Manufacturer: Bourns; Created from: DHufnagel; Manufacturer Part Number: CR0603-FX-2803ELF; PartID: 233; Created On: 25.07.2022 08:26:35; ComponentLink1Description: Datasheet; ComponentLink1URL: https://www.mouser.de/datasheet/2/54/cr-1858361.pdf; Component Type: SMD resistor; Device Package: 0603; Last Updated: 21.02.2024 16:06:06; Mounting Type: SMD; Supplier 1: Mouser; Supplier Part Number 1: 652-CR0603-FX2803ELF; Type: Resistor; Tolerance: 1%; Value: 280k; Live Cycle Status: 1; Stock number: not stored; Supplier 2: LCSC; Supplier Part Number 2: C861797; LCSC Part Number: C861797
R33 = ERJ-6ENF2873V: SMD resistor 1%; Manufacturer: Panasonic; Created from: MGremer; Manufacturer Part Number: ERJ-6ENF2873V; PartID: 154; Created On: 14.12.2020 16:17:14; ComponentLink1Description: Datasheet; ComponentLink1URL: https://www.mouser.de/datasheet/2/315/AOA0000C304-1149620.pdf; Component Type: SMD resistor; Device Package: 0805; Last Updated: 15.02.2023 18:07:29; Mounting Type: SMD; Supplier 1: Mouser; Supplier Part Number 1: 667-ERJ-6ENF2873V; Type: Resistor; Tolerance: 1%; Value: 287k; Live Cycle Status: 1; Stock number: not stored; LCSC Part Number: C228683
R34 = CR0603-FX-9763ELF: SMD resistor 1%, 50V, 100ppm; Manufacturer: Bourns; Created from: DHufnagel; Manufacturer Part Number: CR0603-FX-9763ELF; PartID: 234; Created On: 25.07.2022 08:26:35; ComponentLink1Description: Datasheet; ComponentLink1URL: https://www.mouser.de/datasheet/2/54/cr-1858361.pdf; Component Type: SMD resistor; Device Package: 0603; Last Updated: 15.02.2023 18:14:05; Mounting Type: SMD; Supplier 1: Mouser; Supplier Part Number 1: 652-CR0603FX-9763ELF; Type: Resistor; Tolerance: 1%; Value: 976k; Live Cycle Status: 1; Stock number: not stored; LCSC Part Number: C162980
R35 = CR0603-FX-1823ELF: SMD resistor 1%, 50V, 100ppm; Manufacturer: Bourns; Created from: DHufnagel; Manufacturer Part Number: CR0603-FX-1823ELF; PartID: 235; Created On: 25.07.2022 08:26:35; ComponentLink1Description: Datasheet; ComponentLink1URL: https://www.mouser.de/datasheet/2/54/cr-1858361.pdf; Component Type: SMD resistor; Device Package: 0603; Last Updated: 15.02.2023 18:09:14; Mounting Type: SMD; Supplier 1: Mouser; Supplier Part Number 1: 652-CR0603FX-1823ELF; Type: Resistor; Tolerance: 1%; Value: 182k; Live Cycle Status: 1; Stock number: not stored; LCSC Part Number: C203368
U5 = LM57CISD-10/NOPB: Board Mount Temperature Sensor, -50 - 150°C; Manufacturer: Texas Instruments; Created from: DHufnagel; Manufacturer Part Number: LM57CISD-5/NOPB; PartID: 5; Created On: 30.06.2022 08:21:10; ComponentLink1Description: Datasheet; ComponentLink1URL: https://www.ti.com/general/docs/suppproductinfo.tsp?distId=26&gotoUrl=https://www.ti.com/lit/gpn/lm57; Component Type: Temperature Sensors; Device Package: WSON-8; Last Updated: 14.06.2023 22:16:01; Mounting Type: SMD; Operating Temperature: -50 - 150°C; Supplier 1: Mouser; Supplier Part Number 1: 926-LM57CISD-5/NOPB; Supplier 2: Digi-Key; Supplier Part Number 2: LM57CISD-5/NOPBCT-ND; Type: Temperature Sensor; Live Cycle Status: 1; Stock number: not stored; LCSC Part Number: C2864092
U6 = LTC6992CS6-1#TRMPBF: Switching Controllers PWM with 0% to 100% Pulse Width Control; Manufacturer: Analog Devices; Created from: AGeiger; Manufacturer Part Number: LTC6992CS6-1#TRMPBF; PartID: 11; Created On: 20.07.2022 14:30:26; ComponentLink1Description: Datasheet; ComponentLink1URL: https://www.mouser.de/datasheet/2/609/LTC6992-1-6992-2-6992-3-6992-4-1852873.pdf; Component Type: Switching Controllers; Device Package: SOT-23-6; Last Updated: 14.06.2023 22:16:01; Mounting Type: SMD; Operating Temperature: 0 to 70 °C; Supplier 1: Mouser; Supplier Part Number 1: 584-C6992CS6-1TRMPBF; Type: Switching Controller; Live Cycle Status: 1; Stock number: not stored; Supplier 2: LCSC; Supplier Part Number 2: C581034; LCSC Part Number: C581034
X2 = 4-103327-3: Pin Header, 2.54mm, 1 Pin; Manufacturer: TE Connectivity; Created from: DHufnagel; Number of positions: 1; Manufacturer Part Number: 4-103327-3; PartID: 12; Created On: 18.08.2022 09:37:37; ComponentLink1Description: Datasheet; ComponentLink1URL: https://www.mouser.de/datasheet/2/418/NG_CD_103327_T_baseFilename-749242.pdf; Component Type: Pin Header; Device Package: THT; Last Updated: 18.08.2022 09:41:31; Mounting Type: THT; Operating Temperature: -65 - 105 °C; Series: AMPMODU MOD II; Supplier 1: Mouser; Supplier Part Number 1: 571-4-103327-3; Type: Pin Header; Live Cycle Status: 1; Stock number: not stored; Number of rows: 1

## Sheet DC-Link-Caps.SchDoc
size A4; Author: K.Patel / D. Hufnagel; CompanyName: Technische Hochschule Nürnberg Georg Simon Ohm; Organization: UltraZohm; Address1: Kesslerplatz 12; Address2: 90489 Nürnberg; Address3: GERMANY; SheetNumber: 7; SheetTotal: 9; Website: www.ultrazohm.com
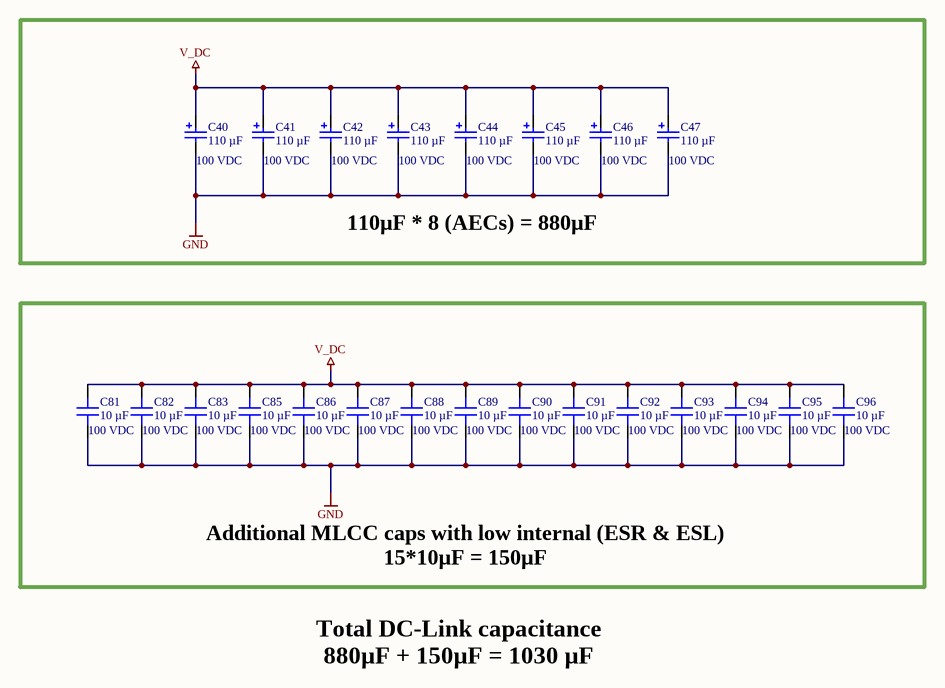
[diagram p7: DC-Link-Caps.SchDoc]

### Parts
C40  110 µF  Voltage Rating: 100 VDC  [CAPAE1300X1400N]
C41  110 µF  Voltage Rating: 100 VDC  [CAPAE1300X1400N]
C42  110 µF  Voltage Rating: 100 VDC  [CAPAE1300X1400N]
C43  110 µF  Voltage Rating: 100 VDC  [CAPAE1300X1400N]
C44  110 µF  Voltage Rating: 100 VDC  [CAPAE1300X1400N]
C45  110 µF  Voltage Rating: 100 VDC  [CAPAE1300X1400N]
C46  110 µF  Voltage Rating: 100 VDC  [CAPAE1300X1400N]
C47  110 µF  Voltage Rating: 100 VDC  [CAPAE1300X1400N]
C81  10 µF  Voltage Rating: 100 VDC  [C_1210_N]
C82  10 µF  Voltage Rating: 100 VDC  [C_1210_N]
C83  10 µF  Voltage Rating: 100 VDC  [C_1210_N]
C85  10 µF  Voltage Rating: 100 VDC  [C_1210_N]
C86  10 µF  Voltage Rating: 100 VDC  [C_1210_N]
C87  10 µF  Voltage Rating: 100 VDC  [C_1210_N]
C88  10 µF  Voltage Rating: 100 VDC  [C_1210_N]
C89  10 µF  Voltage Rating: 100 VDC  [C_1210_N]
C90  10 µF  Voltage Rating: 100 VDC  [C_1210_N]
C91  10 µF  Voltage Rating: 100 VDC  [C_1210_N]
C92  10 µF  Voltage Rating: 100 VDC  [C_1210_N]
C93  10 µF  Voltage Rating: 100 VDC  [C_1210_N]
C94  10 µF  Voltage Rating: 100 VDC  [C_1210_N]
C95  10 µF  Voltage Rating: 100 VDC  [C_1210_N]
C96  10 µF  Voltage Rating: 100 VDC  [C_1210_N]

### Nets
GND: C40.2(N) C41.2(N) C42.2(N) C43.2(N) C44.2(N) C45.2(N) C46.2(N) C47.2(N) C81.1 C82.1 C83.1 C85.1 C86.1 C87.1 C88.1 C89.1 C90.1 C91.1 C92.1 C93.1 C94.1 C95.1 C96.1
V_DC: C40.1(P) C41.1(P) C42.1(P) C43.1(P) C44.1(P) C45.1(P) C46.1(P) C47.1(P) C81.2 C82.2 C83.2 C85.2 C86.2 C87.2 C88.2 C89.2 C90.2 C91.2 C92.2 C93.2 C94.2 C95.2 C96.2

### Notes on the sheet
- 110µF * 8 (AECs) = 880µF
- Additional MLCC caps with low internal (ESR & ESL)
  15*10µF = 150µF
- Total DC-Link capacitance
  880µF + 150µF = 1030 µF
- Title
- Revision:
- Design Engineer:
- Date:
- Project:
- Sheet
- of

### Library data of the parts
C40-C47 = EMHS101ARA111MKE0S: Capacitor, 110µF, 100VDC Al Electrolyt; Manufacturer: CHEMI-CON; Tolerance: 20%; Created from: KPatel; Manufacturer Part Number: EMHS101ARA111MKE0S; PartID: 149; Created On: 6/7/2024 2:59:53 PM; ComponentLink1Description: Datasheet; ComponentLink1URL: https://www.lcsc.com/datasheet/lcsc_datasheet_2401161155_NCC-Nippon-Chemi-Con-EMHS101ARA111MKE0S_C2163387.pdf; Component Type: Capacitor Al Electrolyt; Device Package: KE0; Last Updated: 6/7/2024 2:59:53 PM; Mounting Type: SMD; Operating Temperature: -40 - 125° C; Series: MHS; Supplier 1: Mouser; Supplier Part Number 1: 661-EMHS101ARA111MKE; Supplier 2: LCSC; Supplier Part Number 2: C2163387; Type: Capacitor; Value: 110 µF; Live Cycle Status: 1; LCSC Part Number: C2163387; Stock number: not stored
C81-C83 C85-C96 = GRM32EC72A106KE05L: Capacitor 1210, 100 VDC, 10µF, X7S; Manufacturer: Murata Electronics; Tolerance: 10 %; Created from: DHufnagel; Manufacturer Part Number: GRM32EC72A106KE05L; PartID: 118; Created On: 21.12.2022 14:25:08; ComponentLink1Description: Datasheet; ComponentLink1URL: https://www.mouser.de/datasheet/2/281/1/GRM32EC72A106KE05_01A-1988109.pdf; Component Type: Capacitor 1210; Device Package: 1210; Last Updated: 21.02.2024 14:40:52; Mounting Type: SMD; Operating Temperature: -55 - 125°C; Series: GRM; Supplier 1: Mouser; Supplier Part Number 1: 81-GRM32EC72A106KE05; Type: Capacitor; Value: 10 µF; Live Cycle Status: 1; Stock number: not stored; Supplier 2: LCSC; Supplier Part Number 2: C576517; LCSC Part Number: C576517

## Sheet 2.5V_REF.SchDoc
size A4; Author: K. Patel / D. Hufnagel; Organization: UltraZohm; SheetNumber: 9; SheetTotal: 9; Website: www.ultrazohm.com
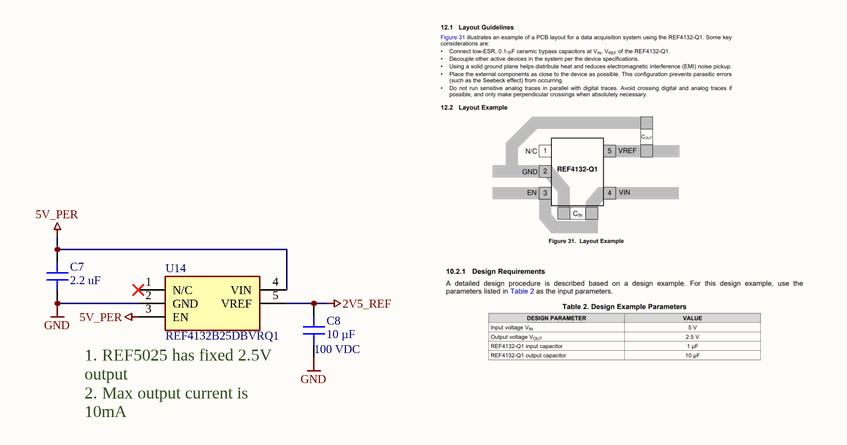
[diagram p8: 2.5V_REF.SchDoc]

### Parts
C7  2.2 uF  [C_0603]
C8  10 µF  Voltage Rating: 100 VDC  [C_1210_N]
U14  REF4132B25DBVRQ1  [SOT95P280X145-5N]

### Nets
2V5_REF: C8.2 U14.5(VREF)
5V_PER: C7.2 U14.3(EN) U14.4(VIN)
GND: C7.1 C8.1 U14.2(GND)

Not connected (* = marked no-connect by the designer): U14 1(N/C)*

### Notes on the sheet
- 1. REF5025 has fixed 2.5V output
  2. Max output current is 10mA
- Title
- Revision:
- Design Engineer:
- Date:
- Project:
- Sheet
- of

### Library data of the parts
C7 = C1608X5R1E225K080AB: Capacitor 0603, 25 VDC, 2.2 uF, X5R; Manufacturer: TDK; Tolerance: 10 %; Voltage Rating: 25VDC; Created from: DHufnagel; Manufacturer Part Number: C1608X5R1E225K080AB; PartID: 96; Created On: 20.07.2022 09:02:16; ComponentLink1Description: Datasheet; ComponentLink1URL: https://product.tdk.com/system/files/dam/doc/product/capacitor/ceramic/mlcc/catalog/mlcc_commercial_general_en.pdf?ref_disty=mouser; Component Type: Capacitor 0603; Device Package: 0603; Last Updated: 20.07.2022 09:02:16; Mounting Type: SMD; Operating Temperature: -55 - 85°C; Series: X5R; Supplier 1: Mouser; Supplier Part Number 1: 810-C1608X5R1E225K; Supplier 2: LCSC; Supplier Part Number 2: C2929194; Type: Capacitor; Value: 2.2 uF; Live Cycle Status: 1; LCSC Part Number: C2929194; Stock number: not stored
C8 = GRM32EC72A106KE05L: as C81 on sheet DC-Link-Caps; Manufacturer Part Number: GRM32EC72A106KE05L; PartID: 118; Created On: 21.12.2022 14:25:08; ComponentLink1Description: Datasheet; ComponentLink1URL: https://www.mouser.de/datasheet/2/281/1/GRM32EC72A106KE05_01A-1988109.pdf; Component Type: Capacitor 1210; Device Package: 1210; Last Updated: 21.02.2024 14:40:52; Mounting Type: SMD; Operating Temperature: -55 - 125°C; Series: GRM; Supplier 1: Mouser; Supplier Part Number 1: 81-GRM32EC72A106KE05; Type: Capacitor; Value: 10 µF; Live Cycle Status: 1; Stock number: not stored; Supplier 2: LCSC; Supplier Part Number 2: C576517; LCSC Part Number: C576517
U14 = REF4132B25DBVRQ1: Voltage Reference, 2.5V, ±0.05%, ±10mA; Manufacturer: Texas Instruments; Created from: DHufnagel; Manufacturer Part Number: REF4132B25DBVRQ1; PartID: 10; Created On: 08.07.2022 12:48:56; ComponentLink1Description: Datasheet; ComponentLink1URL: https://www.ti.com/general/docs/suppproductinfo.tsp?distId=26&gotoUrl=https://www.ti.com/lit/gpn/ref4132-q1; Component Type: Voltage Reference; Device Package: SMD; Last Updated: 08.07.2022 12:59:37; Mounting Type: SMD; Operating Temperature: -40 - 125 °C; Series: -40 - 125 °C; Supplier 1: Mouser; Supplier Part Number 1: 595-REF4132B25DBVRQ1; Supplier 2: Digi-Key; Supplier Part Number 2: 296-REF4132B25DBVRQ1CT-ND; Type: Voltage Reference; Value: 2.5 V; Live Cycle Status: 1; Stock number: not stored

## Nets that join several sheets
2V5_REF: PhaseMeasurements1 (5 pins), PhaseMeasurements2 (5 pins), PhaseMeasurements3 (5 pins), DC-link (5 pins), 2.5V_REF (C8.2 U14.5)
3V3_PER: DigitalCarrierJack (13 pins), Halfbridge1 (C25A.2 C26A.2 U7A.7), Halfbridge2 (C25B.2 C26B.2 U7B.7), Halfbridge3 (C25C.2 C26C.2 U7C.7), TempMeasurements1 (5 pins), TempMeasurements2 (5 pins), TempMeasurements3 (5 pins)
5V_PER: DigitalCarrierJack (F2.2 L12.2 R7.2 TP6.1), PhaseMeasurements1 (L3A.1 L4A.1 L5A.1), PhaseMeasurements2 (L3B.1 L4B.1 L5B.1), PhaseMeasurements3 (L3C.1 L4C.1 L5C.1), DC-link (L6.1 L7.1 L8.1), 2.5V_REF (C7.2 U14.3 U14.4)
-V_DC: Connectors (J4.1), DC-link (R50.2 U11.8)
GND: DigitalCarrierJack (58 pins), Connectors (R5.1 R9.1), PhaseMeasurements1 (15 pins), PhaseMeasurements2 (15 pins), PhaseMeasurements3 (15 pins), Halfbridge1 (20 pins), Halfbridge2 (20 pins), Halfbridge3 (20 pins), DC-link (17 pins), TempMeasurements1 (12 pins), TempMeasurements2 (12 pins), TempMeasurements3 (12 pins), DC-Link-Caps (23 pins), 2.5V_REF (C7.1 C8.1 U14.2)
V_DC: Connectors (J3.1), Halfbridge1 (7 pins), Halfbridge2 (7 pins), Halfbridge3 (7 pins), DC-link (R60.2), DC-Link-Caps (23 pins)
VIN: DigitalCarrierJack (F1.2 R4.2 TP5.1), Halfbridge1 (C60A.1 C62A.1 L1A.1 L2A.1), Halfbridge2 (C60B.1 C62B.1 L1B.1 L2B.1), Halfbridge3 (C60C.1 C62C.1 L1C.1 L2C.1)
GND_TOP: PhaseMeasurements1 (R10A.1 U2A.1), Halfbridge1 (14 pins)
GND_TOP: PhaseMeasurements2 (R10B.1 U2B.1), Halfbridge2 (14 pins)
GND_TOP: PhaseMeasurements3 (R10C.1 U2C.1), Halfbridge3 (14 pins)
I_DC_OUT_N: Connectors (J1.8), DC-link (R57.1)
I_DC_OUT_P: Connectors (J1.7), DC-link (R58.1)
I_OUT_N: Connectors (J2.2), PhaseMeasurements1 (R19A.1)
I_OUT_N: Connectors (J2.6), PhaseMeasurements2 (R19B.1)
I_OUT_N: Connectors (J2.5), PhaseMeasurements3 (R19C.1)
I_OUT_P: Connectors (J2.1), PhaseMeasurements1 (R20A.1)
I_OUT_P: Connectors (J2.3), PhaseMeasurements2 (R20B.1)
I_OUT_P: Connectors (J2.4), PhaseMeasurements3 (R20C.1)
OT_H1: DigitalCarrierJack (X1.50), TempMeasurements1 (R43A.2 U5A.6)
OT_H2: DigitalCarrierJack (X1.74), TempMeasurements2 (R43B.2 U5B.6)
OT_H3: DigitalCarrierJack (X1.73), TempMeasurements3 (R43C.2 U5C.6)
PHASE_CONNECTOR_: Connectors (J7.1), PhaseMeasurements3 (R10C.2 R22C.2 U2C.8)
PHASE_CONNECTOR_: Connectors (J6.1), PhaseMeasurements2 (R10B.2 R22B.2 U2B.8)
PHASE_CONNECTOR_: Connectors (J5.1), PhaseMeasurements1 (R10A.2 R22A.2 U2A.8)
PWM_EN: DigitalCarrierJack (U13.6), Halfbridge1 (U7A.5), Halfbridge2 (U7B.5), Halfbridge3 (U7C.5)
PWM_H: DigitalCarrierJack (X1.17), Halfbridge1 (U7A.2)
PWM_H: DigitalCarrierJack (X1.21), Halfbridge2 (U7B.2)
PWM_H: DigitalCarrierJack (X1.25), Halfbridge3 (U7C.2)
PWM_L: DigitalCarrierJack (X1.18), Halfbridge1 (U7A.3)
PWM_L: DigitalCarrierJack (X1.22), Halfbridge2 (U7B.3)
PWM_L: DigitalCarrierJack (X1.26), Halfbridge3 (U7C.3)
TEMP_H1: DigitalCarrierJack (X1.30), TempMeasurements1 (U6A.6)
TEMP_H2: DigitalCarrierJack (X1.54), TempMeasurements2 (U6B.6)
TEMP_H3: DigitalCarrierJack (X1.53), TempMeasurements3 (U6C.6)
U_OUT_N: Connectors (J1.2), PhaseMeasurements1 (R25A.1)
U_OUT_N: Connectors (J1.6), PhaseMeasurements2 (R25B.1)
U_OUT_N: Connectors (J1.5), PhaseMeasurements3 (R25C.1)
U_OUT_P: Connectors (J1.1), PhaseMeasurements1 (R26A.1)
U_OUT_P: Connectors (J1.3), PhaseMeasurements2 (R26B.1)
U_OUT_P: Connectors (J1.4), PhaseMeasurements3 (R26C.1)
V_DC_OUT_N: Connectors (J2.8), DC-link (R67.1)
V_DC_OUT_P: Connectors (J2.7), DC-link (R68.1)

## Assembly variants
Variant_V1: not fitted J8 R2 R3 X2A X2B X2C